# EAGLE design ISL29125 Breakout-v10 (EAGLE 7.2.0)
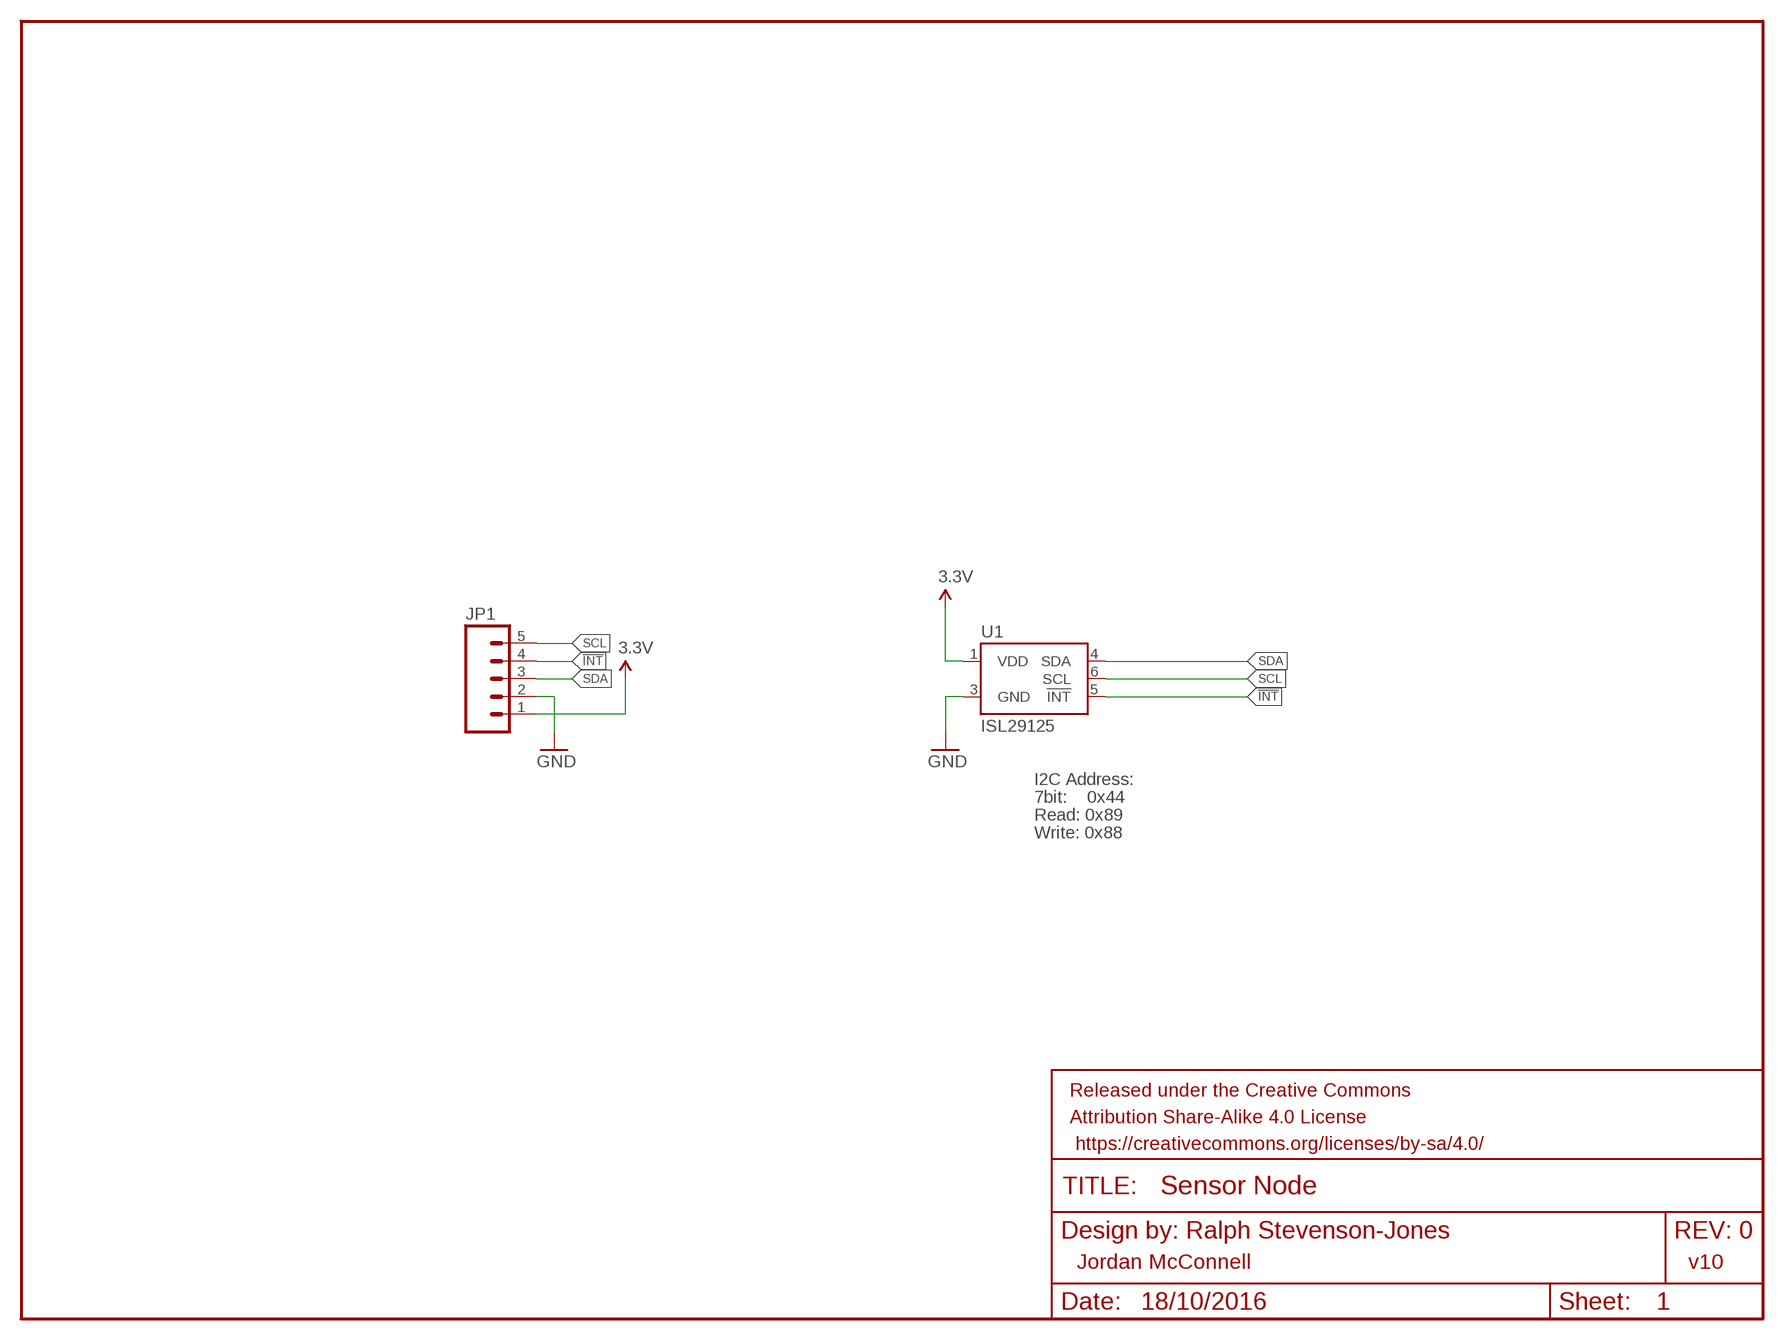
[diagram p0: schematic, sheet 1]

## Parts
FRAME1  FRAME-LETTER  [CREATIVE_COMMONS]
JP1  M05PTH  [1X05]
U1  ISL29125  [ODFN-LD-6]

## Nets
3.3V: JP1.1 U1.1(VDD)
!INT: JP1.4 U1.5(!INT)
GND: JP1.2 U1.3(GND)
SCL: JP1.5 U1.6(SCL)
SDA: JP1.3 U1.4(SDA)

## Notes on the sheet
- I2C Address:
- 7bit:    0x44
- Read: 0x89
- Write: 0x88
- Jordan McConnell | v10

## Library data of the parts
FRAME1 = SparkFun-Aesthetics:FRAME-LETTER: Schematic Frame Standard 8.5x11 US Letter frame; DESIGNER: Ralph Stevenson-Jones; VERSION: v01
JP1 = SparkFun-Connectors:M05: Header 5 Standard 5-pin 0.1" header. Use with straight break away headers (SKU : PRT-00116), right angle break away headers (PRT-00553), swiss pins (PRT-00743), machine pins (PRT-00117), and female headers (PRT-00115). Molex polarized connector foot print use with SKU : PRT-08230 with associated crimp pins and housings.
U1 = connecting_woodbank:ISL29125: The ISL29125 is a low power, high sensitivity RGB color light sensor with an I2C interface.

## Board
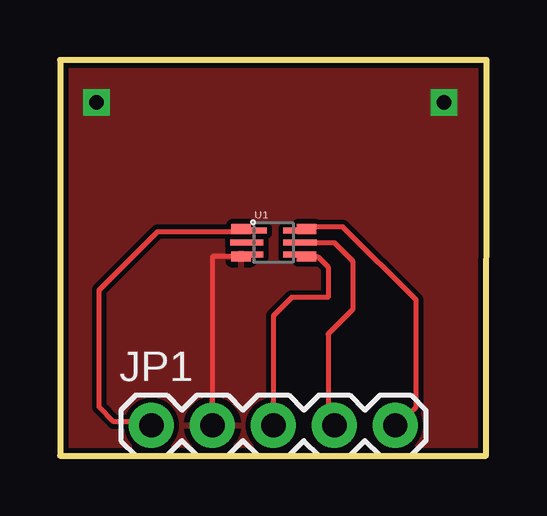
[diagram p1: board, top side]
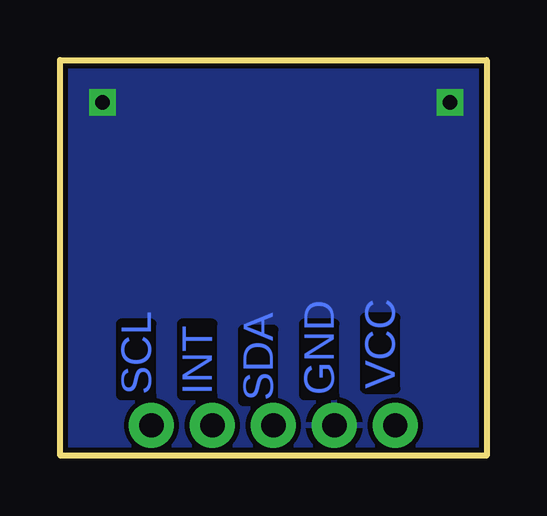
[diagram p2: board, bottom side, seen from below]

Size 17.78 x 16.51 mm. Coordinates in mm from the lower left corner, seen from the top.
Outline: 0,0 17.76,0 17.78,16.51 0,16.51 0,0
Copper layers (1*16): Top 0.035mm / dielectric 1.5mm / Bottom 0.035mm
Design rules "SparkFun": minimum track width 8mil, minimum drill 20mil, track to track 8mil, track to pad 8mil, pad to pad 8mil, via to via 8mil, smd to smd 8mil, copper to edge 8mil, drill to drill 8mil, minimum pad ring 12mil, minimum via ring 10mil, stop-mask expansion 4mil, vias tented up to drill 20mil, thermal gap 10mil

### Footprints (pad centres in the part's own frame; a part is rotated, then mirrored left to right if it is on the bottom)
1X05 = drill 1.016 pad 1.88: 1 0,0; 2 2.54,0; 3 5.08,0; 4 7.62,0; 5 10.16,0
ODFN-LD-6 = smd 0.813 x 0.406: 1 -1.343,0.564; 3 -1.343,-0.58; 4 1.387,-0.58; 6 1.387,0.564 | smd 1.016 x 0.25: 2 -1.292,0; 5 1.292,0 | smd 0.75 x 0.25: 11 -0.645,0.5 | smd 0.6 x 0.25: 12 -0.72,0; 13 -0.72,-0.5; 14 0.72,-0.5; 15 0.72,0; 16 0.72,0.5

### Placement (x,y rotation side)
FRAME1  -7.62,-19.05 0 top  (outside the outline)
JP1  3.81,1.27 0 top
U1  8.89,8.89 0 top

### Tracks (layer width: path | path; a pad name or v marks a point on that pad's centre or on a via)
3.3V
  Top 0.203: U1.1 7.52,9.35 4.06,9.35 1.63,6.91 1.63,2.03 2.23,1.42 3.66,1.42 JP1.1
!INT
  Top 0.203: U1.5 11.43,8.89 12.19,8.13 12.19,6.1 11.18,5.08 11.18,1.52 JP1.4
GND  (via drill 0.6)
  Top 0.203: U1.3 6.35,8.31 JP1.2
  Bottom 0.203: 6.5,1.42 JP1.2
  other vias: 1.52,14.73 16,14.73
  pour Top: -3.3,18.03 19.81,18.03 19.81,-4.32 -3.3,-4.32
  pour Bottom: -1.78,17.02 18.8,17.02 18.8,-2.54 -1.78,-2.54
SCL
  Top 0.203: U1.6 10.36,9.55 11.79,9.55 14.83,6.5 14.83,2.03 14.02,1.22 JP1.5
SDA
  Top 0.203: U1.4 10.74,8.31 11.18,7.87 11.18,6.6 9.65,6.6 8.89,5.84 JP1.3

### Text on the board
Bottom: VCC | GND | INT | SCL | SDA
tNames: Jordan McConnell